# EAGLE design led_serial_strip_small_v1.1 (EAGLE 6.5.0)
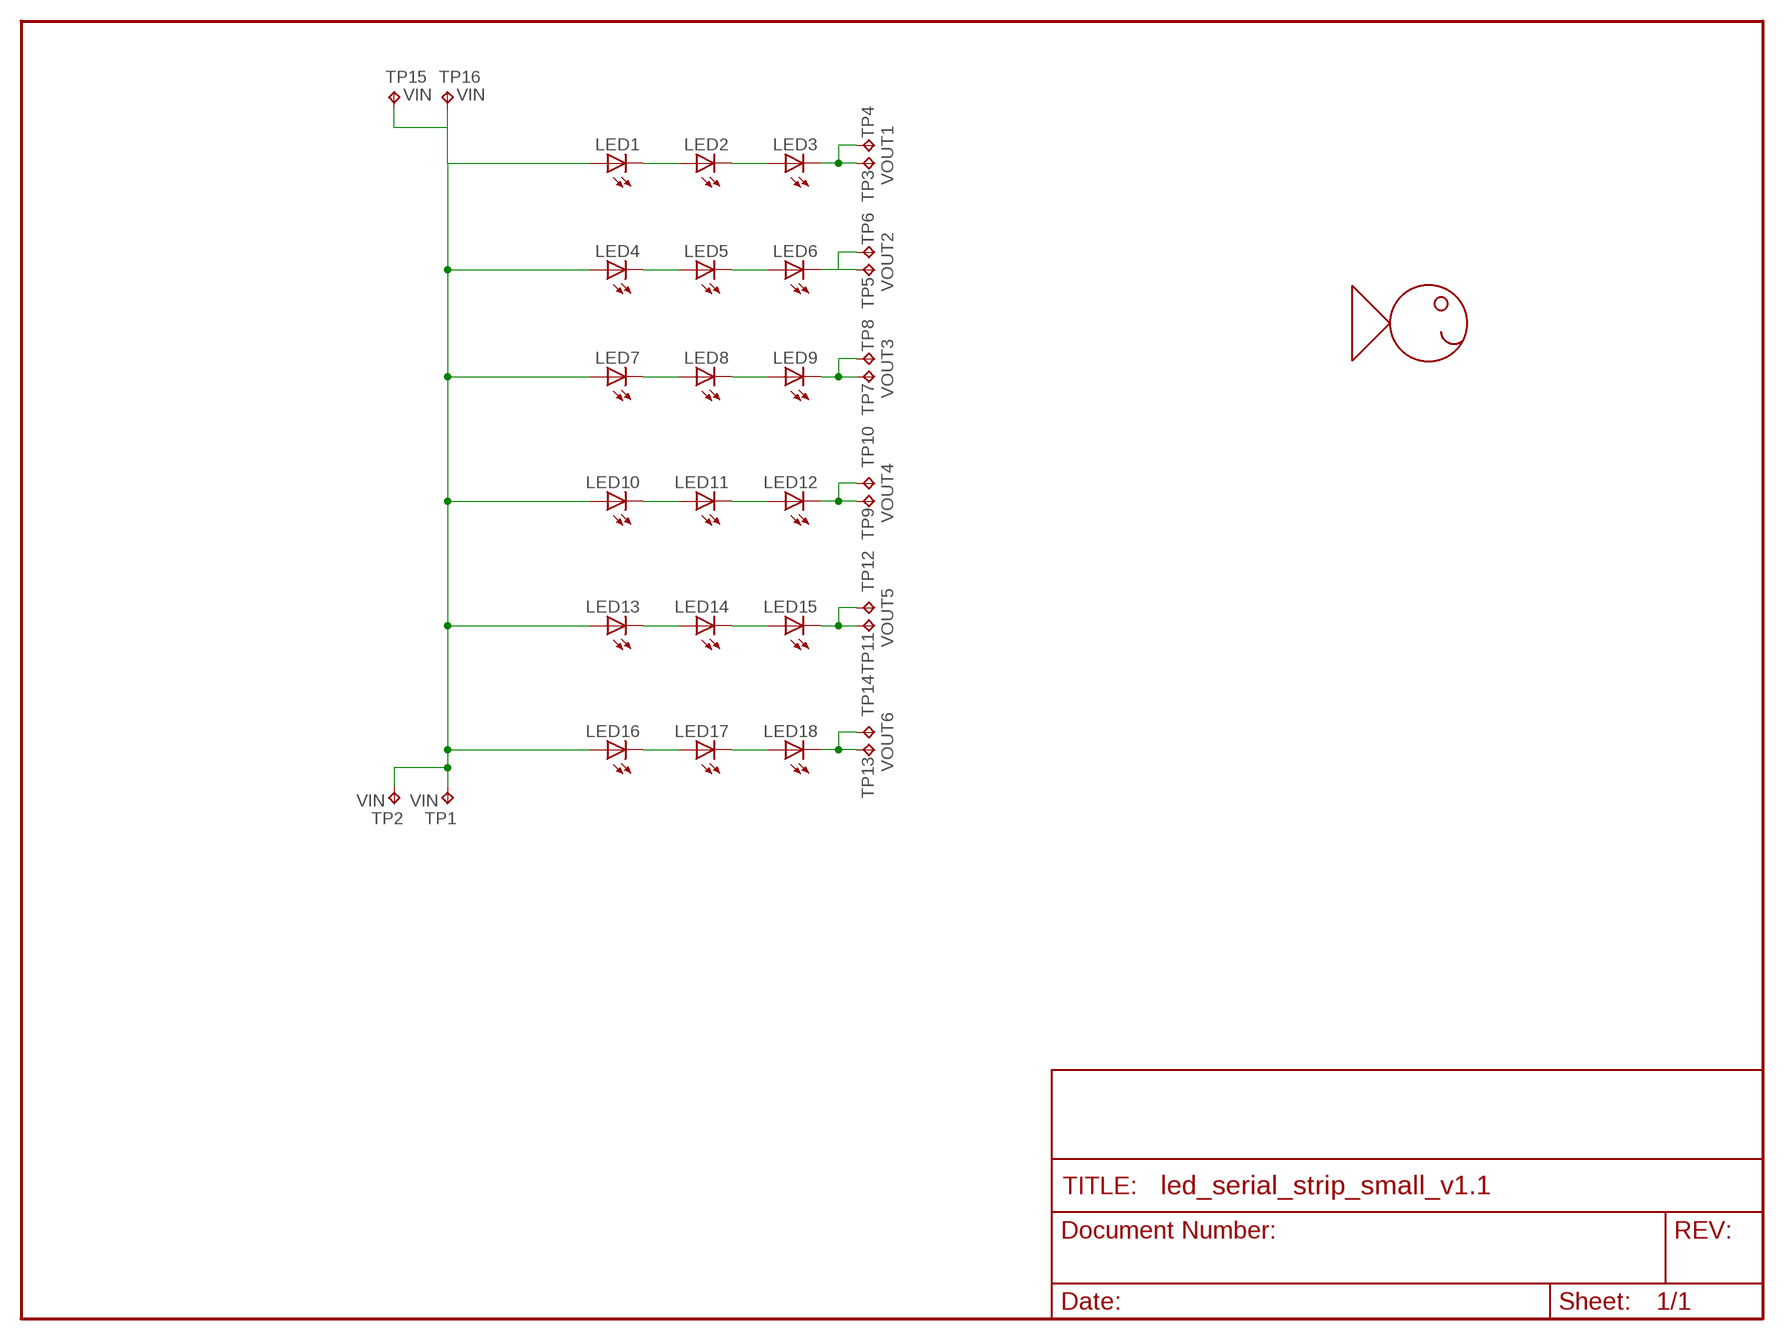
[diagram p0: schematic, sheet 1]

## Parts
LED1  LED0805  [LED_0805]
LED2  LED0805  [LED_0805]
LED3  LED0805  [LED_0805]
LED4  LED0805  [LED_0805]
LED5  LED0805  [LED_0805]
LED6  LED0805  [LED_0805]
LED7  LED0805  [LED_0805]
LED8  LED0805  [LED_0805]
LED9  LED0805  [LED_0805]
LED10  LED0805  [LED_0805]
LED11  LED0805  [LED_0805]
LED12  LED0805  [LED_0805]
LED13  LED0805  [LED_0805]
LED14  LED0805  [LED_0805]
LED15  LED0805  [LED_0805]
LED16  LED0805  [LED_0805]
LED17  LED0805  [LED_0805]
LED18  LED0805  [LED_0805]
TP1  VIN  TEST_POINTPAD1-20  [P1-20]
TP2  VIN  TEST_POINTPAD1-20  [P1-20]
TP3  VOUT1  TEST_POINTPAD1-20  [P1-20]
TP4  VOUT1  TEST_POINTPAD1-20  [P1-20]
TP5  VOUT2  TEST_POINTPAD1-20  [P1-20]
TP6  VOUT2  TEST_POINTPAD1-20  [P1-20]
TP7  VOUT3  TEST_POINTPAD1-20  [P1-20]
TP8  VOUT3  TEST_POINTPAD1-20  [P1-20]
TP9  VOUT4  TEST_POINTPAD1-20  [P1-20]
TP10  VOUT4  TEST_POINTPAD1-20  [P1-20]
TP11  VOUT5  TEST_POINTPAD1-20  [P1-20]
TP12  VOUT5  TEST_POINTPAD1-20  [P1-20]
TP13  VOUT6  TEST_POINTPAD1-20  [P1-20]
TP14  VOUT6  TEST_POINTPAD1-20  [P1-20]
TP15  VIN  TEST_POINTPAD1-20  [P1-20]
TP16  VIN  TEST_POINTPAD1-20  [P1-20]
U$1  FHI_LOGO  [FHI_LOGO]

## Nets
N$2: LED1.C LED2.A
N$3: LED2.C LED3.A
N$7: LED10.C LED11.A
N$8: LED11.C LED12.A
N$9: LED8.C LED9.A
N$10: LED5.C LED6.A
N$11: LED4.C LED5.A
N$12: LED7.C LED8.A
N$16: LED12.C TP9.TP TP10.TP
N$19: LED16.C LED17.A
N$20: LED17.C LED18.A
N$21: LED14.C LED15.A
N$22: LED13.C LED14.A
VIN: LED1.A LED4.A LED7.A LED10.A LED13.A LED16.A TP1.TP TP2.TP TP15.TP TP16.TP
VOUT1: LED3.C TP3.TP TP4.TP
VOUT2: LED6.C TP5.TP TP6.TP
VOUT3: LED9.C TP7.TP TP8.TP
VOUT5: LED15.C TP11.TP TP12.TP
VOUT6: LED18.C TP13.TP TP14.TP

## Library data of the parts
LED1-LED18 = CyberRailGuru:LED: LEDs Standard schematic elements and footprints for 5mm, 3mm, 1206, and 0603 sized LEDs. 5mm - Spark Fun Electronics SKU : COM-00529 (and others)
TP1-TP16 = CyberRailGuru:TEST_POINT: Test pad
U$1 = CyberRailGuru:FHI_LOGO: Fishhead Industries Logo

## Board
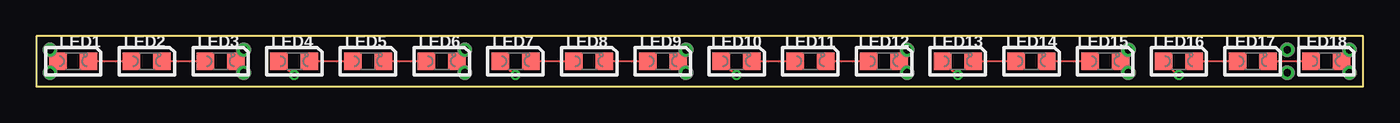
[diagram p1: board, top side]
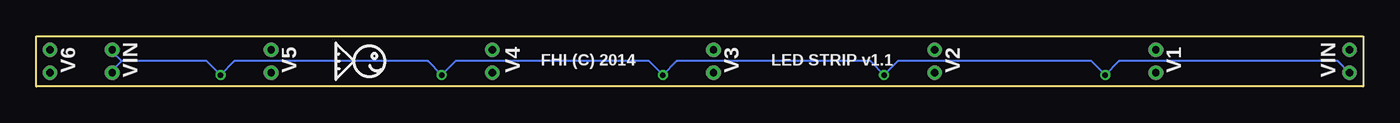
[diagram p2: board, bottom side, seen from below]

Size 91.44 x 3.48 mm. Coordinates in mm from the lower left corner, seen from the top.
Outline: 0,0 91.44,0 91.44,3.48 0,3.48 0,0
Copper layers (1*16): Top 0.035mm / dielectric 1.5mm / Bottom 0.035mm
Design rules "Fusion_eagle_rule_v1.1_tms *": minimum track width 6mil, minimum drill 12mil, track to track 6mil, track to pad 6mil, pad to pad 6mil, via to via 6mil, smd to smd 0mil, copper to edge 10mil, drill to drill 10mil, minimum pad ring 10mil, minimum via ring 6mil, stop-mask expansion 2mil, vias tented up to drill 100mil, thermal gap 10mil

### Footprints (pad centres in the part's own frame; a part is rotated, then mirrored left to right if it is on the bottom)
LED_0805 = smd 1.2 x 1.2: A 0,-1.05; C 0,1.05
P1-20 = drill 0.5: TP 0,0

### Placement (x,y rotation side)
LED1  2.54,1.75 270 top
LED2  7.62,1.75 270 top
LED3  12.7,1.75 270 top
LED4  17.78,1.75 270 top
LED5  22.86,1.75 270 top
LED6  27.94,1.75 270 top
LED7  33.02,1.75 270 top
LED8  38.1,1.75 270 top
LED9  43.18,1.75 270 top
LED10  48.26,1.75 270 top
LED11  53.34,1.75 270 top
LED12  58.42,1.75 270 top
LED13  63.5,1.75 270 top
LED14  68.58,1.75 270 top
LED15  73.66,1.75 270 top
LED16  78.74,1.75 270 top
LED17  83.82,1.75 270 top
LED18  88.9,1.75 270 top
TP1  0.95,0.95 0 top
TP2  0.95,2.54 0 top
TP3  14.29,2.54 0 top
TP4  14.29,0.95 0 top
TP5  29.53,2.54 0 top
TP6  29.53,0.95 0 top
TP7  44.77,2.54 0 top
TP8  44.77,0.95 0 top
TP9  60.01,2.54 0 top
TP10  60.01,0.95 0 top
TP11  75.25,2.54 0 top
TP12  75.25,0.95 0 top
TP13  90.49,2.54 0 top
TP14  90.49,0.95 0 top
TP15  86.2,2.54 0 top
TP16  86.2,0.95 0 top
U$1  69.53,1.75 0 bottom

### Tracks (layer width: path | path; a pad name or v marks a point on that pad's centre or on a via)
N$2
  Top 0.152: LED1.C LED2.A
N$3
  Top 0.152: LED2.C LED3.A
N$7
  Top 0.152: LED10.C LED11.A
N$8
  Top 0.152: LED11.C LED12.A
N$9
  Top 0.152: LED8.C LED9.A
N$10
  Top 0.152: LED5.C LED6.A
N$11
  Top 0.152: LED4.C LED5.A
N$12
  Top 0.152: LED7.C LED8.A
N$16
  Top 0.152: TP9.TP 59.47,2 LED12.C 59.69,1.53 59.69,1.27 TP10.TP
N$19
  Top 0.152: LED16.C LED17.A
N$20
  Top 0.152: LED17.C LED18.A
N$21
  Top 0.152: LED14.C LED15.A
N$22
  Top 0.152: LED13.C LED14.A
VIN  (via drill 0.38)
  Top 0.152: 62.86,1.33 LED13.A 62.45,1.69 v63.5,0.79 | 77.69,1.69 LED16.A 78.64,0.79 v78.74,0.79 | LED10.A 47.21,1.69 v48.26,0.79 | LED7.A 31.97,1.69 v33.02,0.79 | LED4.A 16.73,1.69 v17.78,0.79 | TP1.TP 1.49,1.49 LED1.A 1.49,2 TP2.TP
  Bottom 0.152: 85.57,1.75 79.69,1.75 v78.74,0.79 77.79,1.75 64.45,1.75 v63.5,0.79 62.55,1.75 49.21,1.75 v48.26,0.79 47.31,1.75 33.97,1.75 v33.02,0.79 32.07,1.75 18.73,1.75 v17.78,0.79 16.83,1.75 1.75,1.75 TP1.TP | TP15.TP 86.2,2.38 85.57,1.75 | TP16.TP 86.2,1.11 85.57,1.75
VOUT1
  Top 0.152: TP3.TP 13.75,2 LED3.C 13.75,1.49 TP4.TP
VOUT2
  Top 0.152: TP5.TP 28.99,2 LED6.C 28.99,1.49 TP6.TP
VOUT3
  Top 0.152: TP7.TP 44.23,2 LED9.C 44.23,1.49 TP8.TP
VOUT5
  Top 0.152: 74.61,1.84 LED15.C | LED15.C 74.61,1.65 74.61,1.59 TP12.TP | LED15.C 74.71,2 TP11.TP
VOUT6
  Top 0.152: 89.85,1.65 LED18.C | LED18.C 89.95,2 90.11,2 90.11,2.16 TP13.TP | LED18.C 89.95,1.49 90.11,1.49 90.11,1.33 TP14.TP

### Text on the board
bNames: LED STRIP v1.1 | FHI (C) 2014 | VIN | V1 | V2 | V3 | V4 | V5 | VIN | V6